# EAGLE design HP32W_GVSpinout (EAGLE 7.2.0)
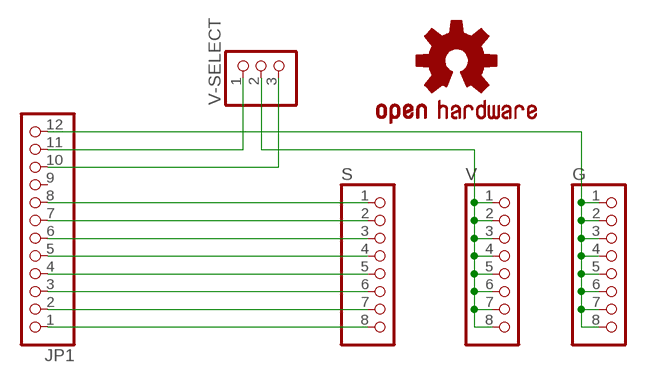
[diagram p0: schematic, sheet 1]

## Parts
G  PINHD-1X8BIG  [1X08-BIG]
JP1  PINHD-1X12-CB  [1X12-CB]
LOGO1  OSHW-LOGOS  [OSHW-LOGO-S]
S  PINHD-1X8BIG  [1X08-BIG]
V  PINHD-1X8BIG  [1X08-BIG]
V-SELECT  PINHD-1X3  [1X03]

## Nets
N$1: JP1.1 S.8
N$2: G.1 G.2 G.3 G.4 G.5 G.6 G.7 G.8 JP1.12
N$3: JP1.2 S.7
N$4: JP1.3 S.6
N$5: JP1.4 S.5
N$6: JP1.5 S.4
N$7: JP1.6 S.3
N$8: JP1.7 S.2
N$9: JP1.8 S.1
N$10: JP1.11 V-SELECT.1
N$11: JP1.10 V-SELECT.3
N$12: V-SELECT.2 V.1 V.2 V.3 V.4 V.5 V.6 V.7 V.8
Unconnected: JP1.9

## Library data of the parts
G S V = adafruit:PINHD-1X8: PIN HEADER
JP1 = adafruit:PINHD-1X12: PIN HEADER
LOGO1 = SparkFun-Aesthetics:OSHW-LOGO: Open Source Hardware Logo This logo indicates the piece of hardware it is found on incorporates a OSHW license and/or adheres to the definition of open source hardware found here: http://freedomdefined.org/OSHW
V-SELECT = adafruit:PINHD-1X3: PIN HEADER

## Board
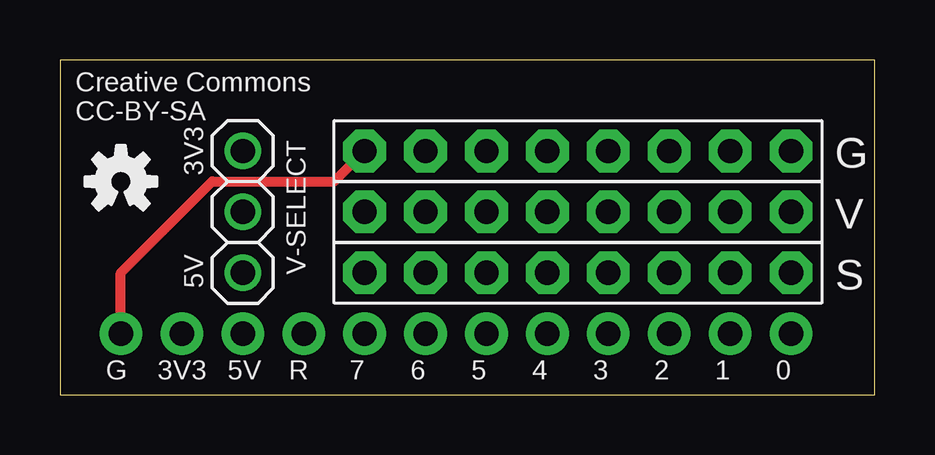
[diagram p1: board, top side]
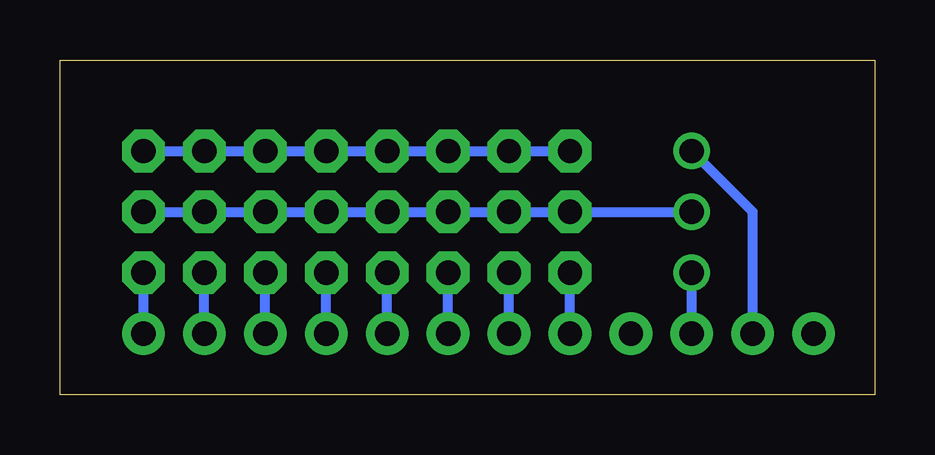
[diagram p2: board, bottom side, seen from below]

Size 33.96 x 13.96 mm. Coordinates in mm from the lower left corner, seen from the top.
Outline: 0,0 33.96,0 33.96,13.96 0,13.96 0,0
Copper layers (1*16): Top 0.035mm / dielectric 1.5mm / Bottom 0.035mm
Design rules "default": minimum track width 10mil, minimum drill 24mil, track to track 8mil, track to pad 8mil, pad to pad 8mil, via to via 8mil, smd to smd 8mil, copper to edge 40mil, drill to drill 8mil, minimum pad ring 10mil, minimum via ring 8mil, stop-mask expansion 4mil, vias tented up to drill 0mil, thermal gap 10mil

### Footprints (pad centres in the part's own frame; a part is rotated, then mirrored left to right if it is on the bottom)
1X08-BIG = drill 1.016 pad 1.778 octagon: 1 -8.89,0; 2 -6.35,0; 3 -3.81,0; 4 -1.27,0; 5 1.27,0; 6 3.81,0; 7 6.35,0; 8 8.89,0
1X12-CB = drill 1.016 pad 1.778: 1 -13.97,0; 2 -11.43,0; 3 -8.89,0; 4 -6.35,0; 5 -3.81,0; 6 -1.27,0; 7 1.27,0; 8 3.81,0; 9 6.35,0; 10 8.89,0; 11 11.43,0; 12 13.97,0
1X03 = drill 1.016: 1 -2.54,0; 2 0,0; 3 2.54,0

### Placement (x,y rotation side)
G  21.59,10.16 0 top
JP1  16.51,2.54 180 top
LOGO1  2.54,8.89 0 top
S  21.59,5.08 0 top
V  21.59,7.62 0 top
V-SELECT  7.62,7.62 270 top

### Tracks (layer width: path | path; a pad name or v marks a point on that pad's centre or on a via)
N$1
  Bottom 0.406: JP1.1 S.8
N$2
  Top 0.406: JP1.12 2.54,5.08 6.35,8.89 11.43,8.89 G.1
  Bottom 0.406: G.8 G.7 G.6 G.5 G.4 G.3 G.2 G.1
N$3
  Bottom 0.406: JP1.2 S.7
N$4
  Bottom 0.406: JP1.3 S.6
N$5
  Bottom 0.406: JP1.4 S.5
N$6
  Bottom 0.406: JP1.5 S.4
N$7
  Bottom 0.406: JP1.6 S.3
N$8
  Bottom 0.406: JP1.7 S.2
N$9
  Bottom 0.406: JP1.8 S.1
N$10
  Bottom 0.406: JP1.11 5.08,7.62 V-SELECT.1
N$11
  Bottom 0.406: JP1.10 V-SELECT.3
N$12
  Bottom 0.406: V.8 V.7 V.6 V.5 V.4 V.3 V.2 V.1 V-SELECT.2

### Text on the board
tNames: Creative Commons / CC-BY-SA | 3V3 | 5V | G | 3V3 | 5V | R | 7 | 6 | 5 | 4 | 3 | 2 | 1 | 0